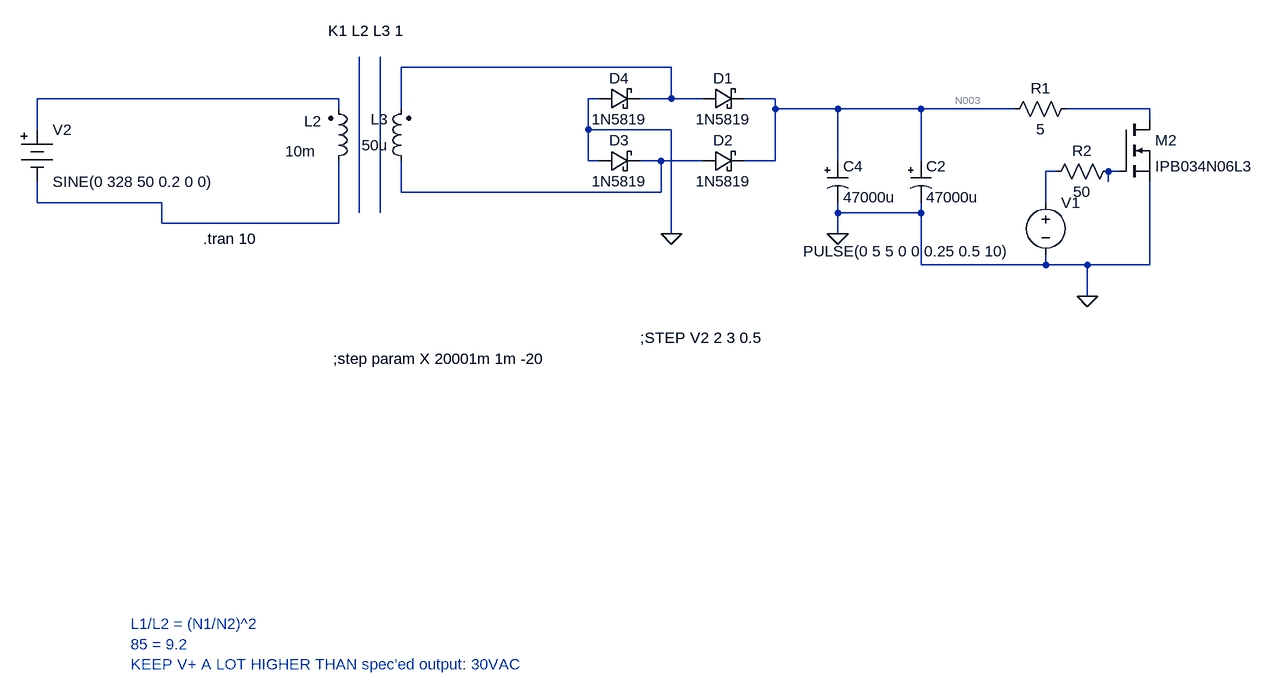
[diagram p0: schematic trafo-calcs-3.asc]
trafo-calcs-3.asc, the LTspice schematic file:
Version 4
SHEET 1 3340 1024
WIRE 1024 0 608 0
WIRE 512 48 48 48
WIRE 912 48 896 48
WIRE 1024 48 1024 0
WIRE 1024 48 976 48
WIRE 1072 48 1024 48
WIRE 1184 48 1136 48
WIRE 512 64 512 48
WIRE 608 64 608 0
WIRE 1184 64 1184 48
WIRE 1280 64 1184 64
WIRE 1408 64 1280 64
WIRE 1552 64 1408 64
WIRE 1760 64 1632 64
WIRE 1760 80 1760 64
WIRE 48 96 48 48
WIRE 896 96 896 48
WIRE 1024 96 896 96
WIRE 896 144 896 96
WIRE 912 144 896 144
WIRE 1008 144 976 144
WIRE 1072 144 1008 144
WIRE 1184 144 1184 64
WIRE 1184 144 1136 144
WIRE 1280 144 1280 64
WIRE 1408 144 1408 64
WIRE 1616 160 1600 160
WIRE 1712 160 1696 160
WIRE 1696 176 1696 160
WIRE 608 192 608 144
WIRE 1008 192 1008 144
WIRE 1008 192 608 192
WIRE 48 208 48 176
WIRE 240 208 48 208
WIRE 1600 208 1600 160
WIRE 544 224 544 -16
WIRE 576 224 576 -16
WIRE 1280 224 1280 208
WIRE 1408 224 1408 208
WIRE 1408 224 1280 224
WIRE 240 240 240 208
WIRE 512 240 512 144
WIRE 512 240 240 240
WIRE 1024 256 1024 96
WIRE 1280 256 1280 224
WIRE 1408 304 1408 224
WIRE 1600 304 1600 288
WIRE 1600 304 1408 304
WIRE 1664 304 1600 304
WIRE 1760 304 1760 176
WIRE 1760 304 1664 304
WIRE 1664 352 1664 304
FLAG 1024 256 0
FLAG 1280 256 0
FLAG 1664 352 0
SYMBOL ind2 496 160 M180
WINDOW 0 -37 77 Left 2
WINDOW 3 -66 31 Left 2
SYMATTR InstName L2
SYMATTR Value 10m
SYMATTR Type ind
SYMATTR SpiceLine Rser=2.5
SYMBOL ind2 624 160 R180
WINDOW 0 36 80 Left 2
WINDOW 3 36 40 Left 2
SYMATTR InstName L3
SYMATTR Value 50u
SYMATTR Type ind
SYMATTR SpiceLine Rser=0.12
SYMBOL polcap 1264 144 R0
WINDOW 3 24 56 Left 2
SYMATTR Value 47000u
SYMATTR InstName C4
SYMATTR SpiceLine V=35 Rser=0.018 Lser=0
SYMATTR Description Capacitor
SYMATTR Type cap
SYMBOL polcap 1392 144 R0
WINDOW 3 24 56 Left 2
SYMATTR Value 47000u
SYMATTR InstName C2
SYMATTR SpiceLine V=35 Rser=0.018 Lser=0
SYMATTR Description Capacitor
SYMATTR Type cap
SYMBOL schottky 912 64 R270
WINDOW 0 32 32 VTop 2
WINDOW 3 0 32 VBottom 2
SYMATTR InstName D4
SYMATTR Value 1N5819
SYMATTR Description Diode
SYMATTR Type diode
SYMBOL res 1648 48 R90
WINDOW 0 0 56 VBottom 2
WINDOW 3 32 56 VTop 2
SYMATTR InstName R1
SYMATTR Value 5
SYMBOL Misc\\battery 48 80 R0
WINDOW 123 0 0 Left 0
WINDOW 39 24 132 Left 2
SYMATTR InstName V2
SYMATTR Value SINE(0 328 50 0.2 0 0)
SYMBOL schottky 1072 64 R270
WINDOW 0 32 32 VTop 2
WINDOW 3 0 32 VBottom 2
SYMATTR InstName D1
SYMATTR Value 1N5819
SYMATTR Description Diode
SYMATTR Type diode
SYMBOL schottky 1072 160 R270
WINDOW 0 32 32 VTop 2
WINDOW 3 0 32 VBottom 2
SYMATTR InstName D2
SYMATTR Value 1N5819
SYMATTR Description Diode
SYMATTR Type diode
SYMBOL schottky 912 160 R270
WINDOW 0 32 32 VTop 2
WINDOW 3 0 32 VBottom 2
SYMATTR InstName D3
SYMATTR Value 1N5819
SYMATTR Description Diode
SYMATTR Type diode
SYMBOL voltage 1600 192 R0
WINDOW 3 -373 91 Left 2
WINDOW 123 0 0 Left 0
WINDOW 39 0 0 Left 0
SYMATTR InstName V1
SYMATTR Value PULSE(0 5 5 0 0 0.25 0.5 10)
SYMBOL res 1712 144 R90
WINDOW 0 0 56 VBottom 2
WINDOW 3 32 56 VTop 2
SYMATTR InstName R2
SYMATTR Value 50
SYMBOL nmos 1712 80 R0
SYMATTR InstName M2
SYMATTR Value IPB034N06L3
TEXT 304 264 Left 2 !.tran 10
TEXT 496 -56 Left 2 !K1 L2 L3 1
TEXT 192 856 Left 2 ;L1/L2 = (N1/N2)^2\n85 = 9.2\nKEEP V+ A LOT HIGHER THAN spec'ed output: 30VAC
TEXT 976 416 Left 2 !;STEP V2 2 3 0.5
TEXT 504 448 Left 2 !;step param X 20001m 1m -20

The netlist it stands for:
* trafo-calcs-3.asc
L2 N008 N002 10m Rser=2.5
L3 N005 N001 50u Rser=0.12
C4 N003 0 47000u V=35 Rser=0.018 Lser=0
C2 N003 0 47000u V=35 Rser=0.018 Lser=0
D4 0 N001 1N5819
R1 N004 N003 5
V2 N002 N008 SINE(0 328 50 0.2 0 0)
D1 N001 N003 1N5819
D2 N005 N003 1N5819
D3 0 N005 1N5819
V1 N006 0 PULSE(0 5 5 0 0 0.25 0.5 10)
R2 N007 N006 50
M2 N004 N007 0 0 IPB034N06L3
.model D D
.lib standard.dio
.model NMOS NMOS
.model PMOS PMOS
.lib standard.mos
.tran 10
K1 L2 L3 1
* L1/L2 = (N1/N2)^2
* 85 = 9.2
* KEEP V+ A LOT HIGHER THAN spec'ed output: 30VAC
;STEP V2 2 3 0.5
;step param X 20001m 1m -20
.backanno
.end

* Results of the author's LTspice run, read from the files saved beside the schematic
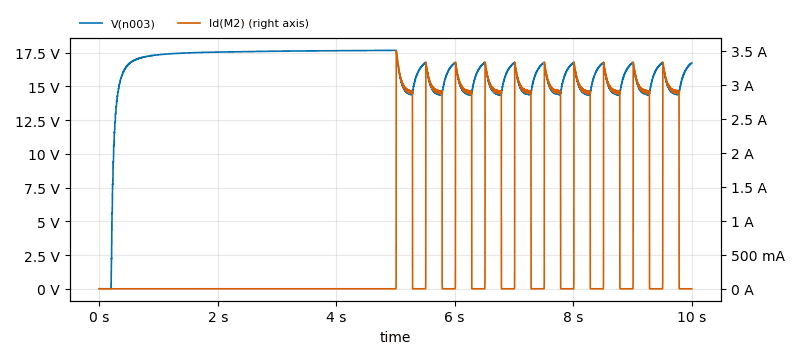
[diagram p1: Transient Analysis of trafo-calcs-3.asc, plotted from the saved traces]
* Transient Analysis, 1 run:
*   V(n003): min 0 V, max 17.67 V, average 16.04 V, rms 16.26 V, last 16.73 V
*   Id(M2): min -4.721 µA, max 3.51 A, average 823.2 mA, rms 1.571 A, last 0 A